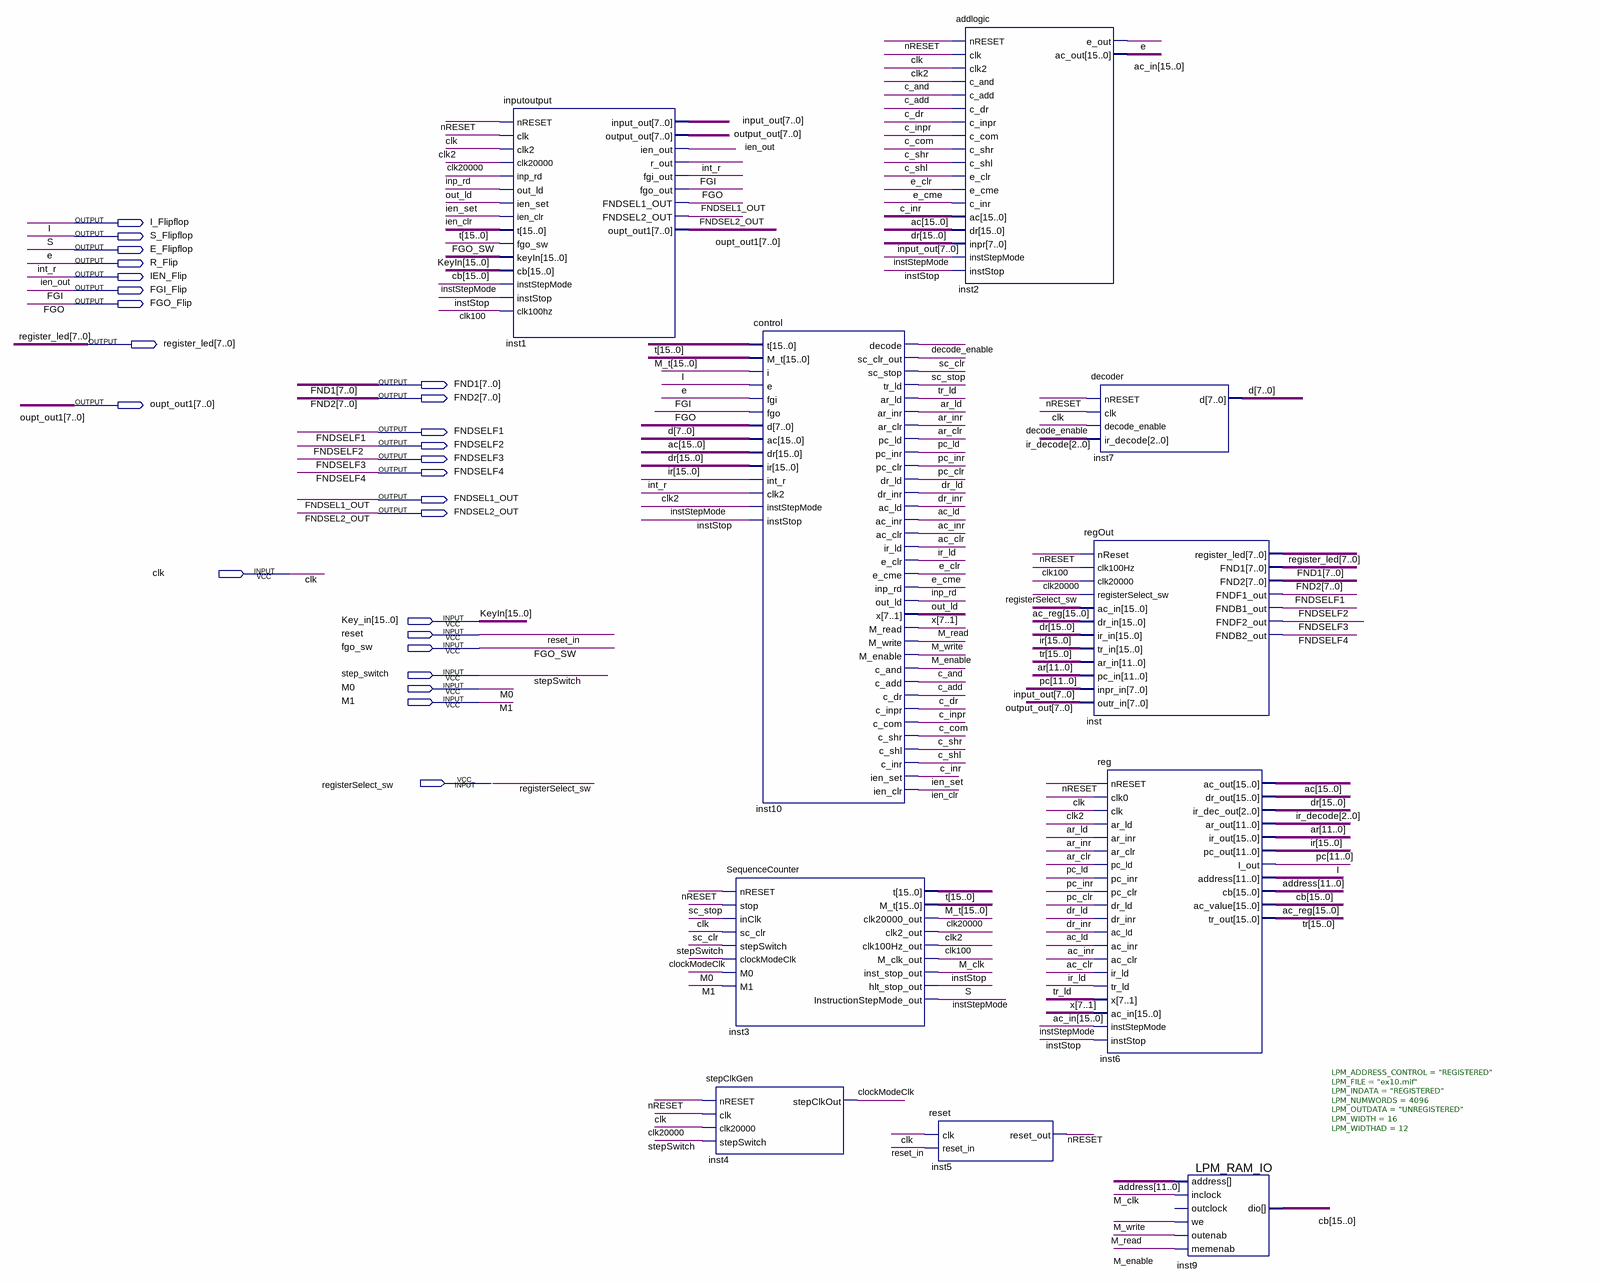
[diagram p0: schematic sheet]
// Quartus schematic simplecomA12.bdf as structural Verilog: 10 symbols, 25 pins
module simplecomA12 (
  input  clk,
  input  [15:0] Key_in,
  input  reset,
  input  fgo_sw,
  input  step_switch,
  input  M0,
  input  M1,
  input  registerSelect_sw,
  output I_Flipflop,
  output S_Flipflop,
  output E_Flipflop,
  output R_Flip,
  output IEN_Flip,
  output FGI_Flip,
  output FGO_Flip,
  output [7:0] register_led,
  output [7:0] FND1,
  output [7:0] FND2,
  output [7:0] oupt_out1,
  output FNDSELF1,
  output FNDSELF2,
  output FNDSELF3,
  output FNDSELF4,
  output FNDSEL1_OUT,
  output FNDSEL2_OUT
);

  wire ac_clr, ac_inr, ac_ld, ar_clr, ar_inr, ar_ld, c_add, c_and, c_com, c_dr, c_inpr, c_inr, c_shl, c_shr,
       clk2, clk100, clk20000, clockModeClk, decode_enable, dr_inr, dr_ld, e_clr, e_cme, ien_clr, ien_set,
       inp_rd, instStepMode, instStop, ir_ld, M_clk, M_enable, M_read, M_write, nRESET, out_ld, pc_clr,
       pc_inr, pc_ld, sc_clr, sc_stop, tr_ld;
  wire [2:0] ir_decode;
  wire [7:0] d, input_out, output_out;
  wire [7:1] x;
  wire [11:0] address, ar, pc;
  wire [15:0] ac, ac_in, ac_reg, cb, dr, ir, M_t, t, tr;

  inputoutput inst1 (
    .nRESET(nRESET), .clk(clk), .clk2(clk2), .clk20000(clk20000), .inp_rd(inp_rd), .out_ld(out_ld),
    .ien_set(ien_set), .ien_clr(ien_clr), .t(t), .fgo_sw(fgo_sw), .keyIn(Key_in), .cb(cb),
    .instStepMode(instStepMode), .instStop(instStop), .clk100hz(clk100), .input_out(input_out),
    .output_out(output_out), .ien_out(IEN_Flip), .r_out(R_Flip), .fgi_out(FGI_Flip), .fgo_out(FGO_Flip),
    .FNDSEL1_OUT(FNDSEL1_OUT), .FNDSEL2_OUT(FNDSEL2_OUT), .oupt_out1(oupt_out1));
  stepClkGen inst4 (
    .nRESET(nRESET), .clk(clk), .clk20000(clk20000), .stepSwitch(step_switch), .stepClkOut(clockModeClk));
  control inst10 (
    .t(t), .M_t(M_t), .i(I_Flipflop), .e(E_Flipflop), .fgi(FGI_Flip), .fgo(FGO_Flip), .d(d), .ac(ac),
    .dr(dr), .ir(ir), .int_r(R_Flip), .clk2(clk2), .instStepMode(instStepMode), .instStop(instStop),
    .decode(decode_enable), .sc_clr_out(sc_clr), .sc_stop(sc_stop), .tr_ld(tr_ld), .ar_ld(ar_ld),
    .ar_inr(ar_inr), .ar_clr(ar_clr), .pc_ld(pc_ld), .pc_inr(pc_inr), .pc_clr(pc_clr), .dr_ld(dr_ld),
    .dr_inr(dr_inr), .ac_ld(ac_ld), .ac_inr(ac_inr), .ac_clr(ac_clr), .ir_ld(ir_ld), .e_clr(e_clr),
    .e_cme(e_cme), .inp_rd(inp_rd), .out_ld(out_ld), .x(x), .M_read(M_read), .M_write(M_write),
    .M_enable(M_enable), .c_and(c_and), .c_add(c_add), .c_dr(c_dr), .c_inpr(c_inpr), .c_com(c_com),
    .c_shr(c_shr), .c_shl(c_shl), .c_inr(c_inr), .ien_set(ien_set), .ien_clr(ien_clr));
  SequenceCounter inst3 (
    .nRESET(nRESET), .stop(sc_stop), .inClk(clk), .sc_clr(sc_clr), .stepSwitch(step_switch),
    .clockModeClk(clockModeClk), .M0(M0), .M1(M1), .t(t), .M_t(M_t), .clk20000_out(clk20000),
    .clk2_out(clk2), .clk100Hz_out(clk100), .M_clk_out(M_clk), .inst_stop_out(instStop),
    .hlt_stop_out(S_Flipflop), .InstructionStepMode_out(instStepMode));
  addlogic inst2 (
    .nRESET(nRESET), .clk(clk), .clk2(clk2), .c_and(c_and), .c_add(c_add), .c_dr(c_dr), .c_inpr(c_inpr),
    .c_com(c_com), .c_shr(c_shr), .c_shl(c_shl), .e_clr(e_clr), .e_cme(e_cme), .c_inr(c_inr), .ac(ac),
    .dr(dr), .inpr(input_out), .instStepMode(instStepMode), .instStop(instStop), .e_out(E_Flipflop),
    .ac_out(ac_in));
  reset inst5 (.clk(clk), .reset_in(reset), .reset_out(nRESET));
  regOut inst (
    .nReset(nRESET), .clk100Hz(clk100), .clk20000(clk20000), .registerSelect_sw(registerSelect_sw),
    .ac_in(ac_reg), .dr_in(dr), .ir_in(ir), .tr_in(tr), .ar_in(ar), .pc_in(pc), .inpr_in(input_out),
    .outr_in(output_out), .register_led(register_led), .FND1(FND1), .FND2(FND2), .FNDF1_out(FNDSELF1),
    .FNDB1_out(FNDSELF2), .FNDF2_out(FNDSELF3), .FNDB2_out(FNDSELF4));
  decoder inst7 (.nRESET(nRESET), .clk(clk), .decode_enable(decode_enable), .ir_decode(ir_decode), .d(d));
  \reg  inst6 (
    .nRESET(nRESET), .clk0(clk), .clk(clk2), .ar_ld(ar_ld), .ar_inr(ar_inr), .ar_clr(ar_clr), .pc_ld(pc_ld),
    .pc_inr(pc_inr), .pc_clr(pc_clr), .dr_ld(dr_ld), .dr_inr(dr_inr), .ac_ld(ac_ld), .ac_inr(ac_inr),
    .ac_clr(ac_clr), .ir_ld(ir_ld), .tr_ld(tr_ld), .x(x), .ac_in(ac_in), .instStepMode(instStepMode),
    .instStop(instStop), .ac_out(ac), .dr_out(dr), .ir_dec_out(ir_decode), .ar_out(ar), .ir_out(ir),
    .pc_out(pc), .I_out(I_Flipflop), .address(address), .ac_value(ac_reg), .tr_out(tr), .cb(cb));
  LPM_RAM_IO #(.LPM_ADDRESS_CONTROL("REGISTERED"), .LPM_FILE("ex10.mif"), .LPM_INDATA("REGISTERED"), .LPM_NUMWORDS(4096), .LPM_OUTDATA("UNREGISTERED"), .LPM_WIDTH(16), .LPM_WIDTHAD(12)) inst9 (
    .address(address), .memenab(M_enable), .inclock(M_clk), .we(M_write), .outenab(M_read), .dio(cb));  // open: outclock

  // Other names for the same wires on the sheet: e = E_Flipflop; FGI = FGI_Flip; FGO = FGO_Flip; I = I_Flipflop;
  //   ien_out = IEN_Flip; int_r = R_Flip; KeyIn[15:0] = Key_in; reset_in = reset; S = S_Flipflop;
  //   stepSwitch = step_switch
endmodule
